# Altium schematic sheet FT4222_Schematic.SchDoc
size A; SheetNumber: 1; SheetTotal: 3
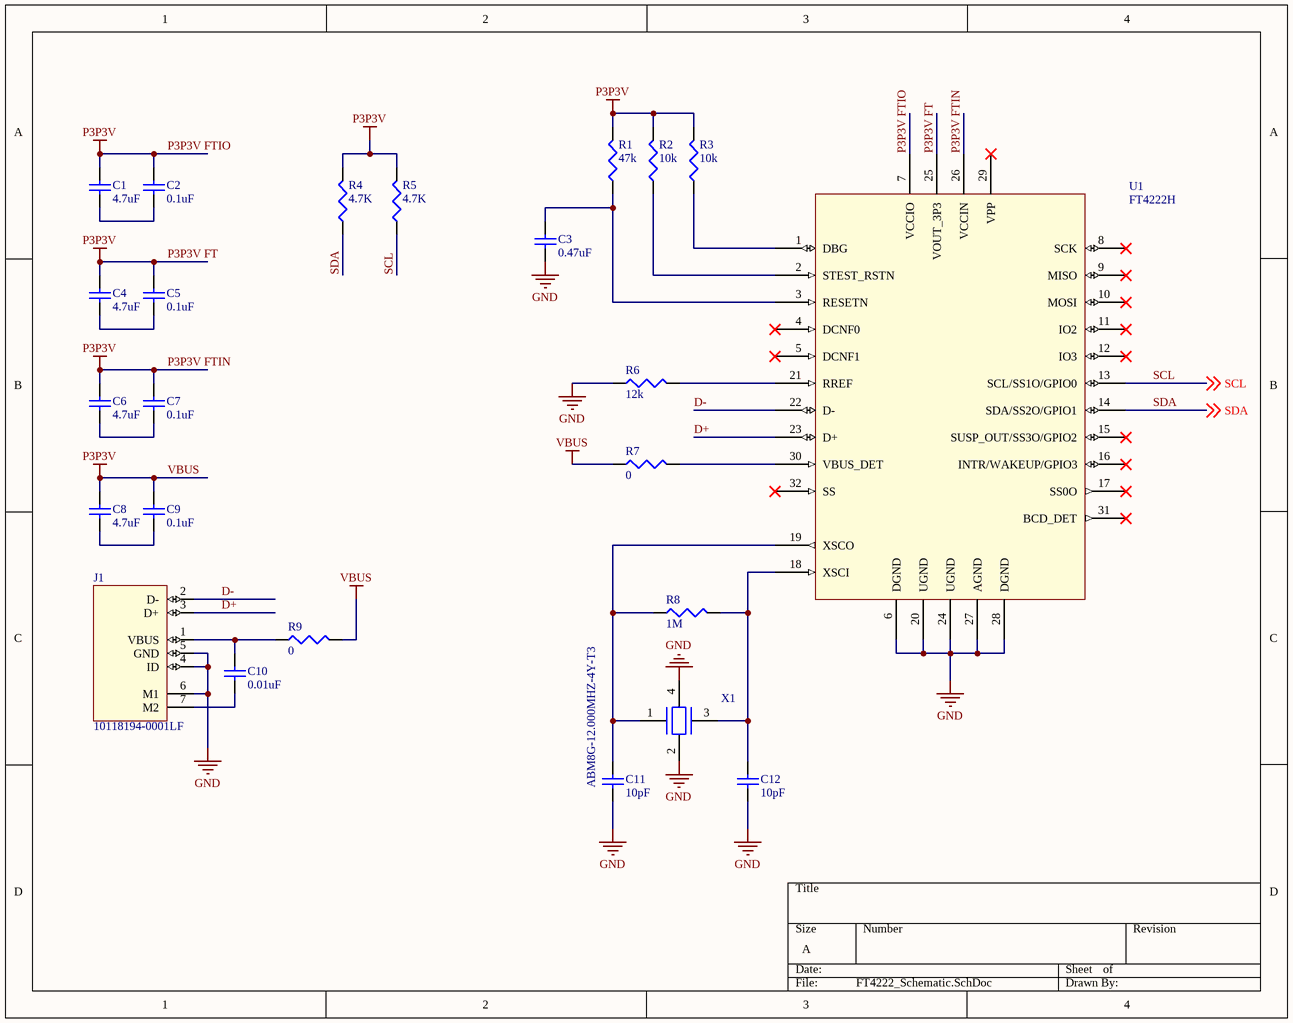
[diagram p0: FT4222_Schematic.SchDoc]

## Parts
C1  4.7uF  [CAP_0402_MED]
C2  0.1uF  [CAP_0402_MED]
C3  0.47uF  [CAP_0603_MED]
C4  4.7uF  [CAP_0402_MED]
C5  0.1uF  [CAP_0402_MED]
C6  4.7uF  [CAP_0402_MED]
C7  0.1uF  [CAP_0402_MED]
C8  4.7uF  [CAP_0402_MED]
C9  0.1uF  [CAP_0402_MED]
C10  0.01uF  [CAP_0402_MED]
C11  10pF  [CAP_0402_MED]
C12  10pF  [CAP_0402_MED]
J1  10118194-0001LF  [10118194-0001LF]
R1  47k  [RES_0402_MED]
R2  10k  [RES_0402_MED]
R3  10k  [RES_0402_MED]
R4  4.7K  [RES_0402_MED]
R5  4.7K  [RES_0402_MED]
R6  12k  [RES_0402_MED]
R7  0  [RES_0603_MED]
R8  1M  [RES_0402_MED]
R9  0  [RES_0402_MED]
U1  FT4222H  [VQFN-32]
X1  ABM8G-12.000MHZ-4Y-T3  [ABM8G]

## Nets
GND: C3.1 C11.1 C12.1 J1.4(ID) J1.5(GND) J1.6(M1) R6.1 U1.6(DGND) U1.20(UGND) U1.24(UGND) U1.27(AGND) U1.28(DGND) X1.2(GND) X1.4(GND)
P3P3V FT: C1.2 C2.2 C4.2 C5.2 C6.2 C7.2 C8.2 C9.2 R1.2 R2.2 R3.2 R4.2 R5.2 R7.1 R9.2 U1.7(VCCIO) U1.25(VOUT_3P3) U1.26(VCCIN)  [also labelled P3P3V, P3P3V FTIN, P3P3V FTIO, VBUS]
D+: J1.3(D+) U1.23(D+)
D-: J1.2(D-) U1.22(D-)
SCL: R5.1 U1.13(SCL/SS1O/GPIO0) ; off-sheet SCL
SDA: R4.1 U1.14(SDA/SS2O/GPIO1) ; off-sheet SDA
NetC1_1: C1.1 C2.1
NetC3_2: C3.2 R1.1 U1.3(RESETN)
NetC4_1: C4.1 C5.1
NetC6_1: C6.1 C7.1
NetC8_1: C8.1 C9.1
NetC10_1: C10.1 J1.7(M2)
NetC10_2: C10.2 J1.1(VBUS) R9.1
NetC11_2: C11.2 R8.1 U1.19(XSCO) X1.1(OSC1)
NetC12_2: C12.2 R8.2 U1.18(XSCI) X1.3(OSC2)
NetR2_1: R2.1 U1.2(STEST_RSTN)
NetR3_1: R3.1 U1.1(DBG)
NetR6_2: R6.2 U1.21(RREF)
NetR7_2: R7.2 U1.30(VBUS_DET)

Not connected (* = marked no-connect by the designer): U1 4(DCNF0)* 5(DCNF1)* 8(SCK)* 9(MISO)* 10(MOSI)* 11(IO2)* 12(IO3)* 15(SUSP_OUT/SS3O/GPIO2)* 16(INTR/WAKEUP/GPIO3)* 17(SS0O)* 29(VPP)* 31(BCD_DET)* 32(SS)*

## Library data of the parts
C1 C4 C6 C8 = CMP-00798-A.1: CAP CER 4.7UF 16V X5R 0402; MfgPartNo: 0402YD475MAT2A; Type: Ceramic - X5R; Mfg: AVX; Package: 0402; Capacitance: 4.7uF; Component Type: Capacitor
C2 C5 C7 C9 C10 = CMP-00496-A.6: CAP CER 0.1UF 25V X7R 0402; SLA Part No: SL00150; MfgPartNo: C1005X7R1E104K; Mfg: TDK; Type: Ceramic - X7R; Package: 402
  C2 C5 C7 C9: Capacitance: 0.1uF
  C10: Capacitance: 0.01uF
C3 = CMP-00498-A.6: CAP CER 0.47UF 16V 10% X7R 0603; SLA Part No: SL00008; MfgPartNo: C0603C474K4RACTU; Mfg: Kemet; Type: Ceramic - X7R; Capacitance: 0.47uF; Package: 603
C11 C12 = CMP-00614-A.1: CAP CER 10PF 50V C0G/NP0 0402; MfgPartNo: GCM1555C1H100FA16D; Type: Ceramic - C0G; Mfg: Murata; Package: 0402; Capacitance: 10pF
J1 = CMP-00755-A.2: 10118194-0001LF CONN USB MICRO B RECPT THRU-SMT R/A; Mfg: Amphenol; Gender: Female; MfgPartNo: 10118194-0001LF; HelpURL: https://www.amphenol-icc.com/media/wysiwyg/files/drawing/10118194.pdf; Mounting: THRU-SMT; Component Type: Connector
R1 = CMP-00852-A.2: RES SMD 47K OHM 1% 1/10W 0402; MfgPartNo: ERJ-U02F4702X; Mfg: Panasonic; Resistance: 47k; Package: 402; Component Type: Resistor
R2 R3 = CMP-00396-A.9: RES SMD 10K OHM 1% 1/10W 0402; SLA Part No: SL00225; MfgPartNo: ERJ-2RKF1002X; Mfg: Panasonic; Package: 402; Resistance: 10k
R4 R5 = CMP-00761-A.1: RES SMD 4K7 OHM 1% 1/16W 0402; MfgPartNo: RC0402FR-074K7P; Mfg: Yageo; Resistance: 4.7K; Package: 402; Component Type: Resistor
R6 = CMP-00612-A.1: RES SMD 12K OHM 1% 1/16W 0402; MfgPartNo: RC0402FR-0712KL; Mfg: Yageo; Package: 0402; Resistance: 12k
R7 = CMP-00342-A.7: RES SMD 0.0OHM JUMPER 1/10W 0603; MfgPartNo: ERJ-3GEY0R00V; SLA Part No: SL00033; Mfg: Panasonic; Package: 603; Resistance: 0
R8 = CMP-00430-A.9: RES SMD 1M OHM 1% 1/10W 0402; MfgPartNo: ERJ-2RKF1004X; SLA Part No: SL00141; Mfg: Panasonic; Package: 402; Resistance: 1M
R9 = CMP-00341-A.9: RES SMD 0.0OHM JUMPER 1/10W 0402; SLA Part No: SL00128; MfgPartNo: ERJ-2GE0R00X; Mfg: Panasonic; Package: 402; Resistance: 0
U1 = CMP-00851-A.3: FT4222H USB2.0 TO QUADSPI/I2C BRIDGE IC VQFN-32; Mfg: FTDI; MfgPartNo: FT4222H; Package: VQFN-32; HelpURL: http://www.ftdichip.com/Support/Documents/DataSheets/ICs/DS_FT4222H.pdf; Component Type: Interface
X1 = CMP-00613-A.2: CRYSTAL 12.0000MHZ 10PF SMD; Mfg: Abracon; MfgPartNo: ABM8G-12.000MHZ-4Y-T3; Package: 4-SMD